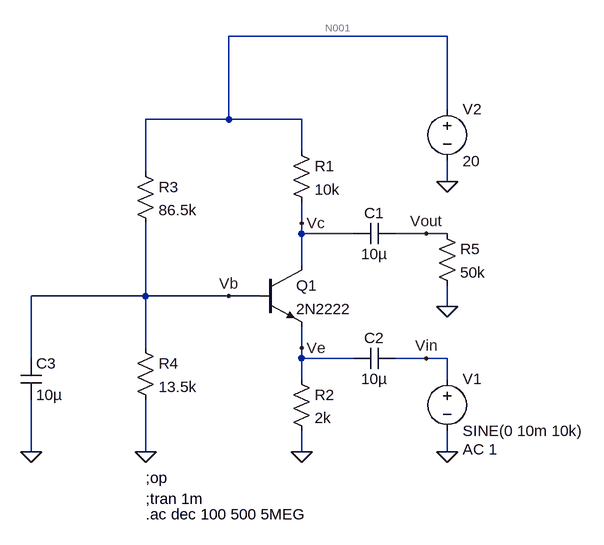
[diagram p0: schematic CB Amplifier.asc]
CB Amplifier.asc, the LTspice schematic file:
Version 4
SHEET 1 880 680
WIRE 480 -224 144 -224
WIRE 480 -112 480 -224
WIRE 144 -96 144 -224
WIRE 144 -96 16 -96
WIRE 256 -96 144 -96
WIRE 256 -48 256 -96
WIRE 16 -16 16 -96
WIRE 480 0 480 -32
WIRE 256 64 256 32
WIRE 256 80 256 64
WIRE 336 80 256 80
WIRE 448 80 400 80
WIRE 480 80 448 80
WIRE 256 128 256 80
WIRE 16 176 16 64
WIRE 16 176 -160 176
WIRE 144 176 16 176
WIRE 192 176 144 176
WIRE 480 192 480 160
WIRE 16 256 16 176
WIRE 256 256 256 224
WIRE -160 272 -160 176
WIRE 256 272 256 256
WIRE 336 272 256 272
WIRE 448 272 400 272
WIRE 480 272 448 272
WIRE 256 304 256 272
WIRE 480 304 480 272
WIRE -160 416 -160 336
WIRE 16 416 16 336
WIRE 256 416 256 384
WIRE 480 416 480 384
FLAG 16 416 0
FLAG 256 416 0
FLAG 480 416 0
FLAG 480 192 0
FLAG 480 0 0
FLAG 256 64 Vc
FLAG 144 176 Vb
FLAG 256 256 Ve
FLAG 448 80 Vout
FLAG 448 272 Vin
FLAG -160 416 0
SYMBOL npn 192 128 R0
SYMATTR InstName Q1
SYMATTR Value 2N2222
SYMBOL res 240 -64 R0
SYMATTR InstName R1
SYMATTR Value 10k
SYMBOL res 240 288 R0
SYMATTR InstName R2
SYMATTR Value 2k
SYMBOL res 0 -32 R0
SYMATTR InstName R3
SYMATTR Value 86.5k
SYMBOL res 0 240 R0
SYMATTR InstName R4
SYMATTR Value 13.5k
SYMBOL cap 400 64 R90
WINDOW 0 0 32 VBottom 2
WINDOW 3 32 32 VTop 2
SYMATTR InstName C1
SYMATTR Value 10µ
SYMBOL cap 400 256 R90
WINDOW 0 0 32 VBottom 2
WINDOW 3 32 32 VTop 2
SYMATTR InstName C2
SYMATTR Value 10µ
SYMBOL voltage 480 288 R0
WINDOW 123 24 124 Left 2
WINDOW 39 0 0 Left 0
SYMATTR Value2 AC 1
SYMATTR InstName V1
SYMATTR Value SINE(0 10m 10k)
SYMBOL res 464 64 R0
SYMATTR InstName R5
SYMATTR Value 50k
SYMBOL voltage 480 -128 R0
WINDOW 123 0 0 Left 0
WINDOW 39 0 0 Left 0
SYMATTR InstName V2
SYMATTR Value 20
SYMBOL cap -176 272 R0
SYMATTR InstName C3
SYMATTR Value 10µ
TEXT 16 456 Left 2 !;op
TEXT 16 488 Left 2 !;tran 1m
TEXT 16 512 Left 2 !.ac dec 100 500 5MEG

The netlist it stands for:
* CB Amplifier.asc
Q1 Vc Vb Ve 0 2N2222
R1 N001 Vc 10k
R2 Ve 0 2k
R3 N001 Vb 86.5k
R4 Vb 0 13.5k
C1 Vout Vc 10µ
C2 Vin Ve 10µ
V1 Vin 0 SINE(0 10m 10k) AC 1
R5 Vout 0 50k
V2 N001 0 20
C3 Vb 0 10µ
.model NPN NPN
.model PNP PNP
.lib standard.bjt
;op
;tran 1m
.ac dec 100 500 5MEG
.backanno
.end

* Results of the author's LTspice run, read from the files saved beside the schematic
* Operating Point, zero values left out:
*   V(vc) = 10.08 V
*   V(vb) = 2.646 V
*   V(ve) = 1.993 V
*   V(n001) = 20 V
*   Ic(Q1) = 991.6 µA
*   Ib(Q1) = 4.629 µA
*   Ie(Q1) = -996.3 µA
*   I(R4) = 196 µA
*   I(R3) = 200.6 µA
*   I(R2) = 996.3 µA
*   I(R1) = 991.6 µA
*   I(V2) = -1.192 mA
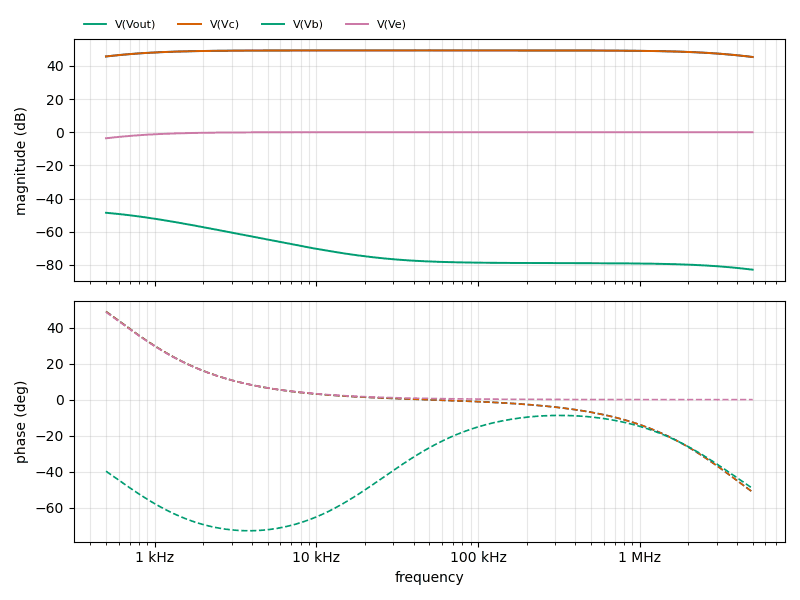
[diagram p1: AC Analysis of CB Amplifier.asc, plotted from the saved traces]
* AC Analysis, 1 run:
*   V(Vout): 45.70 dB at 500 Hz, 45.38 dB at 5 MHz, peak 49.36 dB at 48.86 kHz, 3 dB below the peak at 574.4 Hz and 4.082 MHz
*   V(Vc): 45.70 dB at 500 Hz, 45.38 dB at 5 MHz, peak 49.36 dB at 48.86 kHz, 3 dB below the peak at 574.4 Hz and 4.082 MHz
*   V(Vb): -48.60 dB at 500 Hz, -82.95 dB at 5 MHz, peak -48.60 dB at 500 Hz, 3 dB below the peak at 911.7 Hz
*   V(Ve): -3.65 dB at 500 Hz, 0.00 dB at 5 MHz, peak 0.00 dB at 561 kHz, 3 dB below the peak at 574.5 Hz